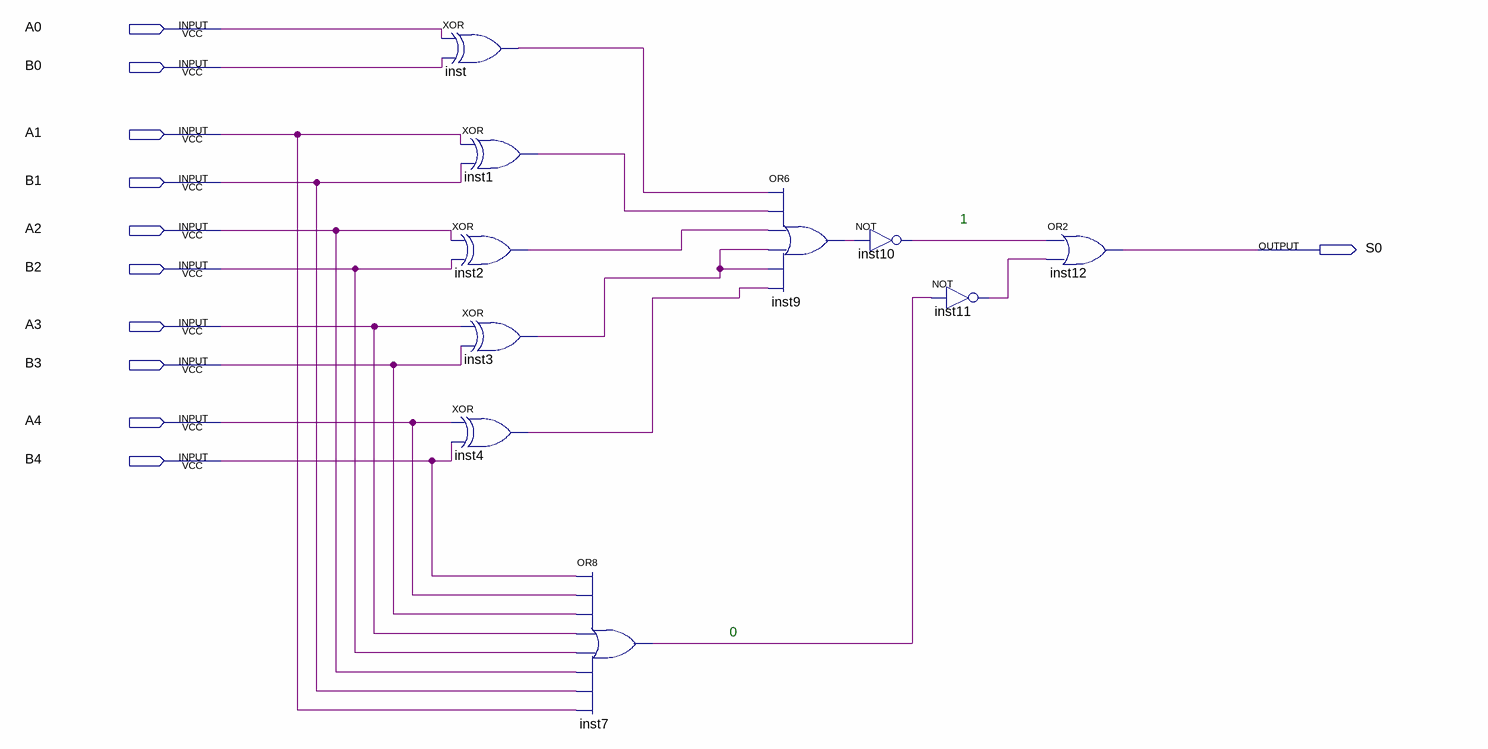
[diagram p0: schematic sheet]
// Quartus schematic Block3.bdf as structural Verilog: 10 symbols, 11 pins
module Block3 (
  input  A0,
  input  B0,
  input  A1,
  input  B1,
  input  A2,
  input  B2,
  input  A3,
  input  B3,
  input  A4,
  input  B4,
  output S0
);

  wire inst1_out, inst2_out, inst3_out, inst4_out, inst7_out, inst9_out, inst10_out, inst11_out, inst_out;

  xor inst (inst_out, A0, B0);
  xor inst2 (inst2_out, A2, B2);
  xor inst4 (inst4_out, A4, B4);
  xor inst1 (inst1_out, A1, B1);
  xor inst3 (inst3_out, A3, B3);
  or inst7 (inst7_out, B4, A4, B3, A3, B2, A2, B1, A1);
  or inst9 (inst9_out, inst_out, inst1_out, inst2_out, inst3_out, inst3_out, inst4_out);
  not inst10 (inst10_out, inst9_out);
  not inst11 (inst11_out, inst7_out);
  or inst12 (S0, inst10_out, inst11_out);

  // Notes on the sheet:
  //   1
  //   0
endmodule
